# EAGLE design radio_fm (EAGLE 7.1.0)
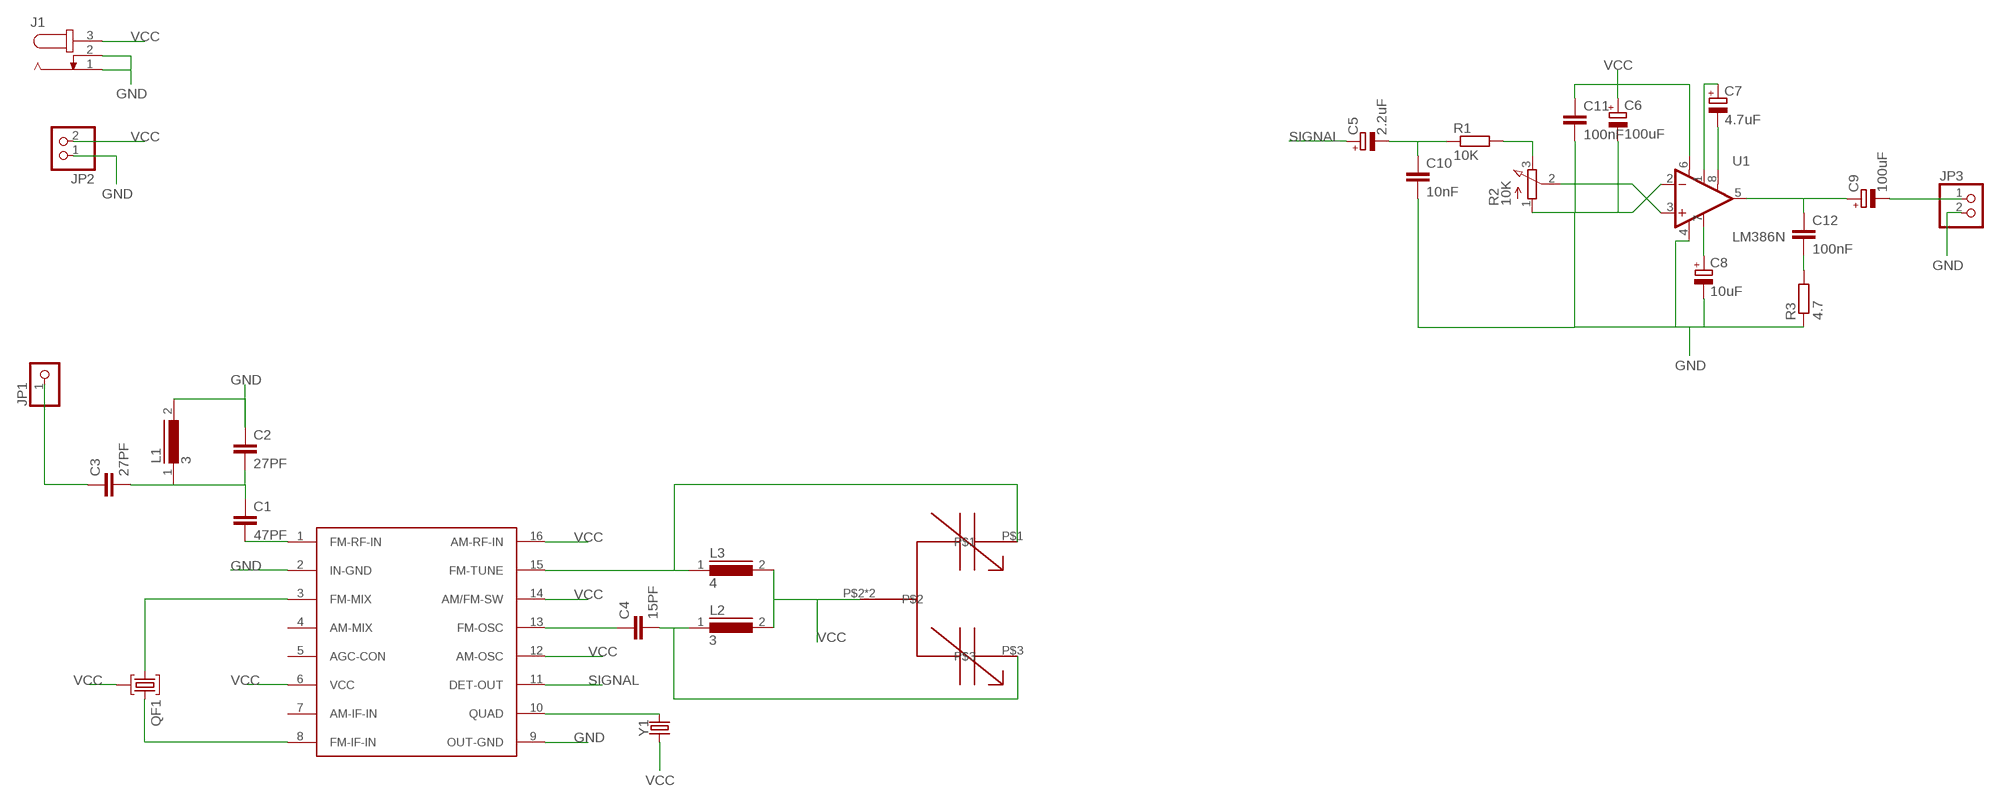
[diagram p0: schematic, sheet 1]

## Parts
C1  47PF  C-EU025-040X050  [C025-040X050]
C2  27PF  C-EU025-040X050  [C025-040X050]
C3  27PF  C-EU025-040X050  [C025-040X050]
C4  15PF  C-EU025-040X050  [C025-040X050]
C5  2.2uF  CPOL-EUE2,5-6E  [E2,5-6E]
C6  100uF  CPOL-EUE2,5-6E  [E2,5-6E]
C7  4.7uF  CPOL-EUE2,5-6E  [E2,5-6E]
C8  10uF  CPOL-EUE2,5-6E  [E2,5-6E]
C9  100uF  CPOL-EUE2,5-6E  [E2,5-6E]
C10  10nF  C-EU050-030X075  [C050-030X075]
C11  100nF  C-EU050-030X075  [C050-030X075]
C12  100nF  C-EU050-030X075  [C050-030X075]
J1  JACK-PLUG0  [SPC4077]
JP1  PINHD-1X1  [1X01]
JP2  PINHD-1X2  [1X02]
JP3  PINHD-1X2  [1X02]
L1  3  82114R  [82114R]
L2  3  82114R  [82114R]
L3  4  82114R  [82114R]
QF1  10M7AHC49T  [HC49U]
R1  10K  R-EU_0207/7  [0207/7]
R2  10K  3RP/1610N  [3RP/1610N]
R3  4.7  R-EU_0207/7  [0207/7]
U1  LM386N  LM386  [DIP08]
U$1  TA2003  [DIL16]
U$2  VARCO_KEMATIAN_V2  [VARCO_KEMATIAN2]
Y1  CRYSTALPTH-HC49US  [HC49US]

## Nets
GND: C2.1 C6.- C8.- C10.2 C11.2 J1.1 J1.2 JP2.1 JP3.2 L1.2 R2.1(A) R3.1 U1.2(-IN) U1.4(V-) U$1.2(IN-GND) U$1.9(OUT-GND)
N$1: C1.1 C2.2 C3.2 L1.1
N$2: C3.1 JP1.1
N$3: C1.2 U$1.1(FM-RF-IN)
N$4: QF1.1 U$1.3(FM-MIX)
N$5: QF1.3 U$1.8(FM-IF-IN)
N$6: U$1.10(QUAD) Y1.2
N$7: C4.1 U$1.13(FM-OSC)
N$8: L3.1 U$1.15(FM-TUNE) U$2.P$1
N$9: C4.2 L2.1 U$2.P$3
N$10: C5.- C10.1 R1.1
N$11: R1.2 R2.3(E)
N$12: R2.2(S) U1.3(+IN)
N$13: C12.2 R3.2
N$14: C8.+ U1.7(BP)
N$15: C9.+ C12.1 U1.5(OUT)
N$16: C7.- U1.8(GAIN)
N$17: C7.+ U1.1(GAIN)
N$18: C9.- JP3.1
SIGNAL: C5.+ U$1.11(DET-OUT)
VCC: C6.+ C11.1 J1.3 JP2.2 L2.2 L3.2 QF1.2 U1.6(V+) U$1.6(VCC) U$1.12(AM-OSC) U$1.14(AM/FM-SW) U$1.16(AM-RF-IN) U$2.P$2 U$2.P$4 Y1.1
Unconnected: U$1.4(AM-MIX) U$1.5(AGC-CON) U$1.7(AM-IF-IN)

## Library data of the parts
C1-C4 C10-C12 = rcl:C-EU: CAPACITOR, European symbol
C5-C9 = rcl:CPOL-EU: POLARIZED CAPACITOR, European symbol
J1 = con-jack:JACK-PLUG: DC POWER JACK Power Jack, DC, Right Angle, Through Hole, Rated 5A at 16VDC, PC Terminals Distributor: Farnell (www.Farnell.de) Drawing: 84N1161.pdf / 84N1162.pdf Manufacturer: SPC Technology (www.spctechnology.com) Type: SPC4077 / SPC 4078; OC_FARNELL: unknown; OC_NEWARK: unknown
JP1 = pinhead:PINHD-1X1: PIN HEADER
JP2 JP3 = pinhead:PINHD-1X2: PIN HEADER
L1-L3 = inductors:82114R: INDUCTOR
QF1 = crystal:10M*A: Monolithic Crystal Filters Source: www.vanlong.com; OC_FARNELL: unknown; OC_NEWARK: unknown
R1 R3 = rcl:R-EU_: RESISTOR, European symbol
R2 = pot:3RP/1610N: 16mm Potentiometer one level Source: http://www.alphapotentiometers.net/html/16mm_pot_2.html
U1 = SparkFun-IC-Amplifiers:LM386: low voltage audio power amplifier SparkFun Products FabFM Radio Kit <https://www.sparkfun.com/products/11043> (KIT-11043); PROD_ID: IC-10899
U$1 = uln-udn:TA2003
U$2 = diy_bojar:VARCO_KEMATIAN_V2
Y1 = SparkFun-Clocks:CRYSTAL: Crystals (Generic) These are passive quartz crystals, which can be used as a clock source for a microcontroller. Crystal's are two-terminal devices. They require external "load" capacitors to generate an oscillating signal.

## Board
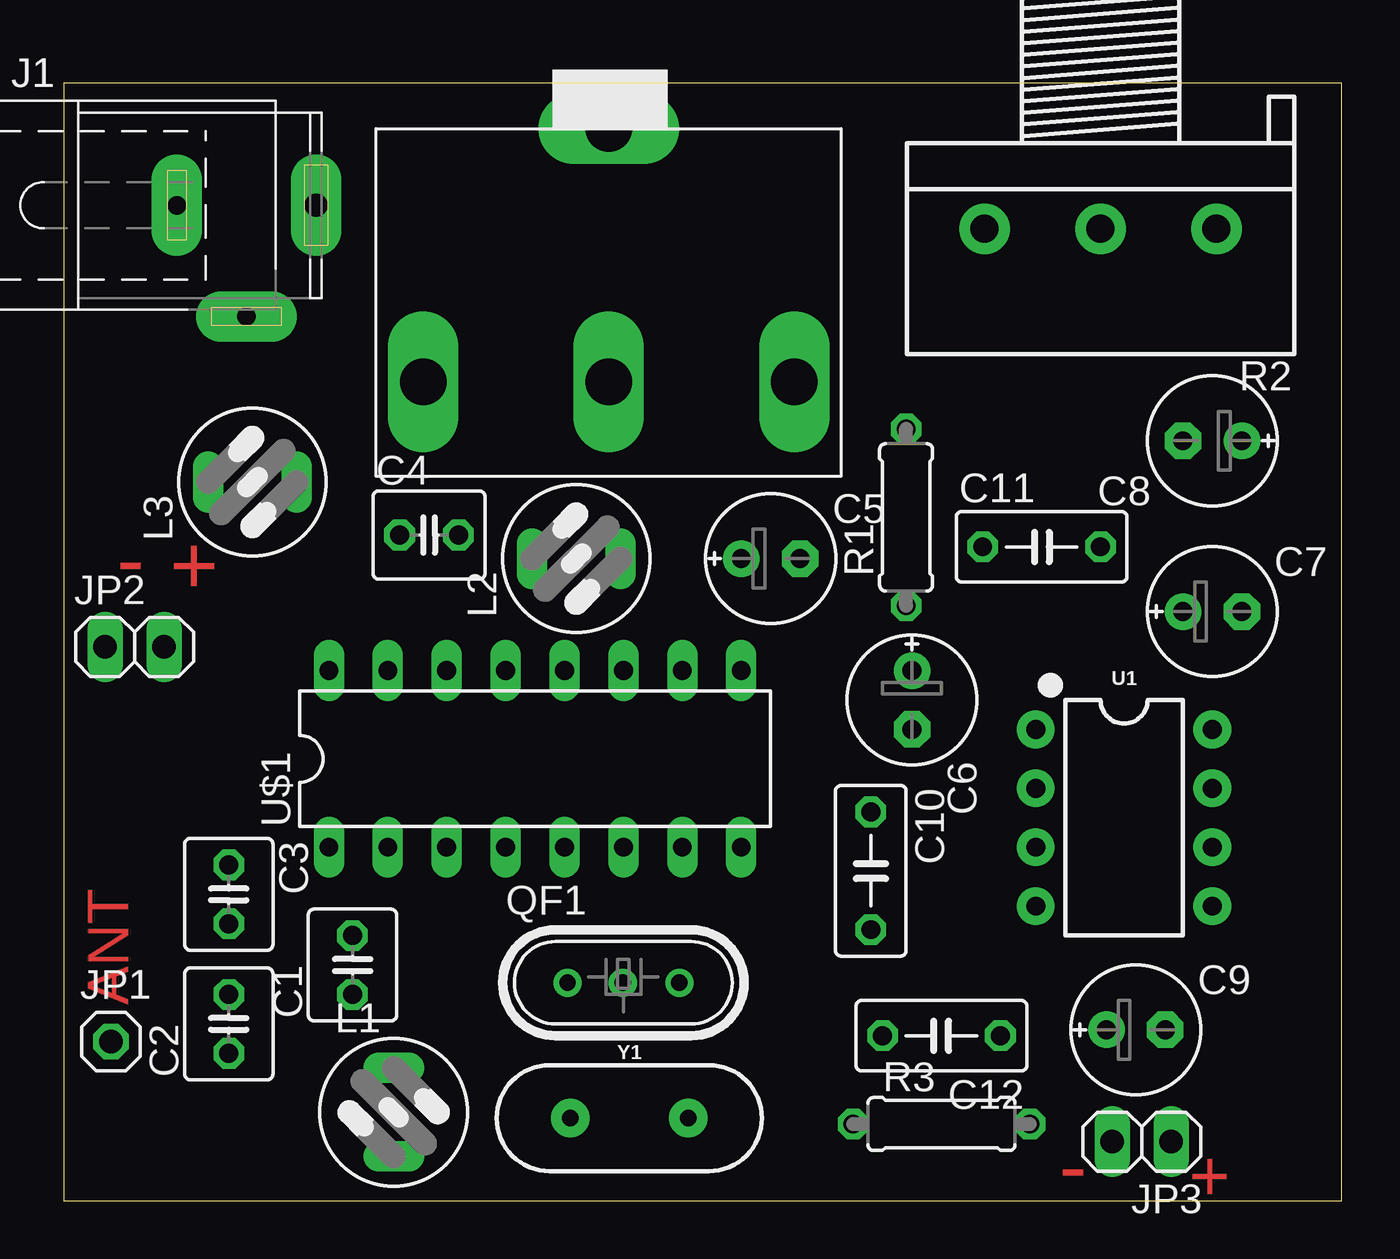
[diagram p1: board, top side]
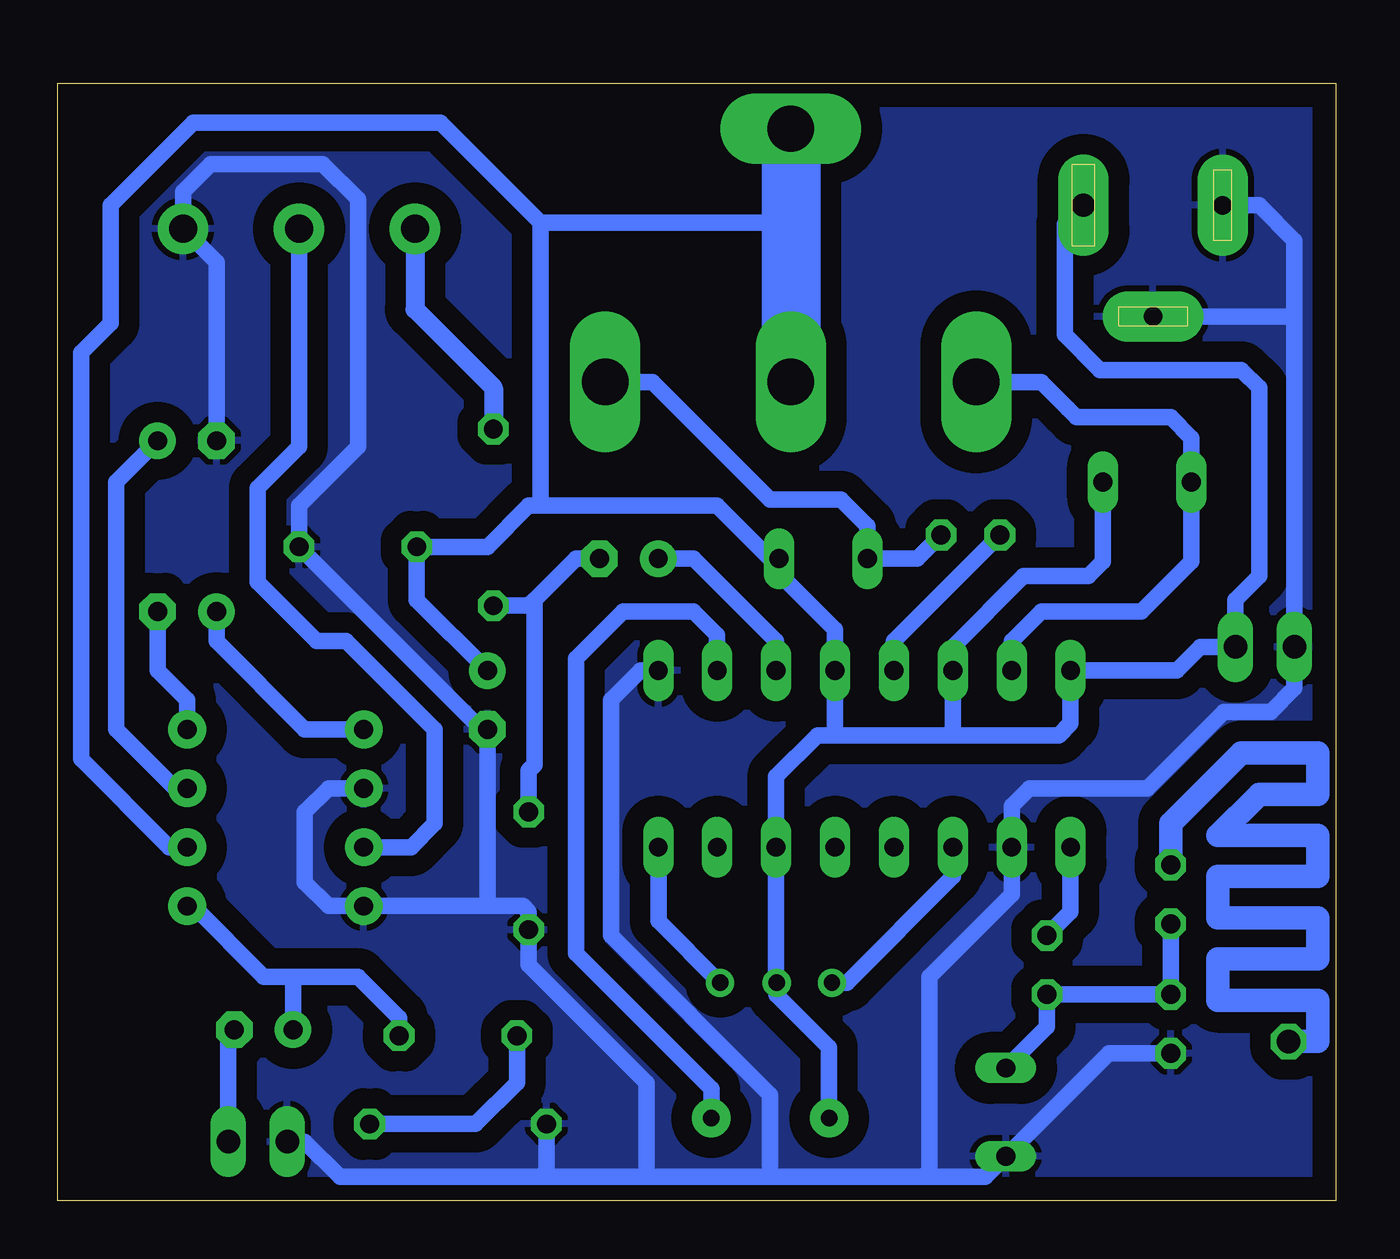
[diagram p2: board, bottom side, seen from below]

Size 55.1 x 48.18 mm. Coordinates in mm from the lower left corner, seen from the top.
Outline: 0,0 55.1,0 55.1,48.18 0,48.18 0,0
Copper layers (1*16): Top 0.035mm / dielectric 1.5mm / Bottom 0.035mm
Design rules "default *": minimum track width 10mil, minimum drill 24mil, track to track 35mil, track to pad 35mil, pad to pad 8mil, via to via 8mil, smd to smd 8mil, copper to edge 40mil, drill to drill 8mil, minimum pad ring 10mil, minimum via ring 8mil, stop-mask expansion 4mil, vias tented up to drill 0mil, thermal gap 10mil

### Footprints (pad centres in the part's own frame; a part is rotated, then mirrored left to right if it is on the bottom)
C025-040X050 = drill 0.813 octagon: 1 -1.27,0; 2 1.27,0
E2,5-6E = drill 0.813 pad 1.575: + -1.27,0 | drill 0.813 pad 1.575 octagon: - 1.27,0
C050-030X075 = drill 0.813 octagon: 1 -2.54,0; 2 2.54,0
SPC4077 = drill 0.8 pad 2.184 long: 1 -3,0; 2 0,-4.8 | drill 1 pad 2.184 long: 3 3,0
1X01 = drill 1.016 octagon: 1 0,0
1X02 = drill 1.016 long: 1 -1.27,0; 2 1.27,0
82114R = drill 0.813 long: 1 0,1.905; 2 0,-1.905
HC49U = drill 0.7 pad 1.2: 1 -2.413,0; 2 -0.027,0; 3 2.413,0
0207/7 = drill 0.813 octagon: 1 -3.81,0; 2 3.81,0
3RP/1610N = drill 1.2 pad 2.184: 1 -5,0; 2 0,0; 3 5,0
DIP08 = drill 0.813 pad 1.626: 1 -3.81,-3.81; 2 -1.27,-3.81; 3 1.27,-3.81; 4 3.81,-3.81; 5 3.81,3.81; 6 1.27,3.81; 7 -1.27,3.81; 8 -3.81,3.81
DIL16 = drill 0.813 long: 1 -8.89,-3.81; 2 -6.35,-3.81; 3 -3.81,-3.81; 4 -1.27,-3.81; 5 1.27,-3.81; 6 3.81,-3.81; 7 6.35,-3.81; 8 8.89,-3.81; 9 8.89,3.81; 10 6.35,3.81; 11 3.81,3.81; 12 1.27,3.81; 13 -1.27,3.81; 14 -3.81,3.81; 15 -6.35,3.81; 16 -8.89,3.81
VARCO_KEMATIAN2 = drill 2 pad 3.048 long: P$1 -8.128,-1.016; P$2 -0.127,-1.016; P$3 7.874,-1.016; P$4 -0.127,9.906
HC49US = drill 0.7 pad 1.651: 1 -2.54,0; 2 2.54,0

### Placement (x,y rotation side)
C1  12.45,10.16 90 top
C2  7.11,7.62 90 top
C3  7.11,13.21 270 top
C4  15.75,28.7 0 top
C5  30.48,27.69 0 top
C6  36.58,21.59 270 top
C7  49.53,25.4 0 top
C8  49.53,32.77 180 top
C9  46.23,7.37 0 top
C10  34.8,14.22 270 top
C11  42.16,28.19 0 top
C12  37.85,7.11 180 top
J1  7.87,42.93 0 top
JP1  2.03,6.86 0 top
JP2  3.05,23.88 0 top
JP3  46.48,2.54 180 top
L1  14.22,3.81 0 top
L2  22.1,27.69 90 top
L3  8.13,30.99 90 top
QF1  24.13,9.4 0 top
R1  36.32,29.46 90 top
R2  44.7,41.91 180 top
R3  37.85,3.3 0 top
U1  45.72,16.51 270 top
U$1  20.32,19.05 0 top
U$2  23.62,36.32 0 top
Y1  24.38,3.56 0 top

### Tracks (layer width: path | path; a pad name or v marks a point on that pad's centre or on a via)
GND
  Bottom 0.711: U$1.9 29.97,22.86 31.24,21.59 31.24,11.43 24.38,4.57 24.38,1.02 | 24.38,1.02 29.72,1.02 | 17.78,1.02 24.38,1.02 | C2.1 9.78,6.35 L1.2 15.11,1.02 17.78,1.02 | 17.78,1.02 17.53,1.27 17.53,9.65 13.97,13.21 U$1.2 13.97,17.02 13.21,17.78 8.13,17.78 4.83,21.08 2.79,21.08 1.78,22.1 JP2.1 1.78,38.1 | 1.78,38.1 1.78,41.4 3.3,42.93 J1.1 | J1.2 1.8,38.13 1.78,38.1 | U1.2 43.43,17.78 44.45,16.76 44.45,13.72 43.43,12.7 U1.4 36.58,12.7 | 36.58,12.7 35.05,12.7 34.8,12.45 C10.2 34.8,10.16 29.72,5.08 29.72,1.02 | 36.58,12.7 C6.- 36.83,20.32 C11.2 44.7,29.97 42.16,32.51 42.16,43.18 43.69,44.7 48.51,44.7 49.7,43.51 R2.1 48.26,40.47 C8.- | JP3.2 44.45,2.54 42.93,1.02 34.29,1.02 | 29.72,1.02 34.29,1.02 | R3.1 34.04,1.27 34.29,1.02
  pour Bottom: 0,48.26 55.12,48.26 55.12,0 0,0
N$1
  Bottom 0.711: C3.2 C2.2 C1.1 12.45,7.49 L1.1
N$2
  Bottom 1.016: JP1.1 0.76,6.86 0.76,8.64 5.08,8.64 5.08,10.41 0.76,10.41 0.76,12.19 5.08,12.19 5.08,13.97 0.76,13.97 0.76,15.75 5.08,15.75 3.3,17.53 0.76,17.53 0.76,19.3 4.06,19.3 7.11,16.26 C3.1
N$3
  Bottom 0.711: U$1.1 11.43,12.45 C1.2
N$4
  Bottom 0.711: U$1.3 16.51,13.97 21.08,9.4 QF1.1
N$5
  Bottom 0.711: U$1.8 29.21,12.07 QF1.3
N$6
  Bottom 0.711: Y1.2 26.92,4.83 32.77,10.67 32.77,23.37 30.73,25.4 27.69,25.4 26.67,24.38 U$1.10
N$7
  Bottom 0.711: C4.1 19.05,24.13 U$1.13
N$8
  Bottom 0.711: U$1.15 13.97,24.13 12.7,25.4 8.38,25.4 6.22,27.56 L3.1 6.22,32.89 7.11,33.78 11.18,33.78 11.56,34.16 12.7,35.31 U$2.P$1
N$9
  Bottom 0.711: C4.2 18.03,27.69 L2.1 20.19,29.08 21.34,30.23 24.38,30.23 29.46,35.31 U$2.P$3
N$10
  Bottom 0.711: C10.1 34.8,18.54 34.54,18.8 34.54,25.91 | R1.1 34.8,25.65 34.54,25.91 | C5.- 32.77,27.69 34.54,25.91
N$11
  Bottom 0.813: R2.3 39.7,38.43 36.32,35.05 R1.2
N$12
  Bottom 0.711: U1.3 39.88,15.24 38.86,16.26 38.86,20.32 42.67,24.13 43.94,24.13 46.48,26.67 46.48,30.73 44.7,32.51 R2.2
N$13
  Bottom 0.711: R3.2 37.08,3.3 35.31,5.08 C12.2
N$14
  Bottom 0.711: U1.7 50.04,17.78 52.58,20.32 52.58,30.99 C8.+
N$15
  Bottom 0.711: U1.5 49.28,12.7 46.23,9.65 44.96,9.65 | C12.1 40.39,7.87 42.16,9.65 44.96,9.65 | C9.+ 44.96,9.65
N$16
  Bottom 0.711: C7.- 50.8,22.86 49.53,21.59 U1.8
N$17
  Bottom 0.711: U1.1 44.45,20.32 48.26,24.13 C7.+
N$18
  Bottom 0.711: JP3.1 47.75,7.11 C9.-
SIGNAL
  Bottom 0.711: C5.+ 27.69,27.69 24.13,24.13 U$1.11
VCC
  Bottom 0.711: Y1.1 21.84,6.6 24.1,8.86 QF1.2 24.13,9.43 U$1.6 24.13,18.29 22.35,20.07 21.59,20.07 | 16.76,20.07 11.94,20.07 11.43,20.57 U$1.16 6.86,22.86 5.84,23.88 JP2.2 4.32,25.91 3.3,26.92 3.3,35.05 4.06,35.81 10.16,35.81 11.68,37.34 11.68,42.12 J1.3 | 16.76,20.07 21.59,20.07 | 21.59,20.07 U$1.12 21.59,24.64 24,27.05 L2.2 24.38,27.69 26.67,29.97 34.29,29.97 | 16.76,20.07 16.51,20.32 U$1.14 16.51,23.88 13.46,26.92 10.67,26.92 10.03,27.56 L3.2 | 34.29,42.16 23.49,42.16 | 34.29,29.97 34.8,29.97 36.58,28.19 C11.1 39.62,25.91 C6.+ | 34.29,29.97 34.29,42.16 | 34.29,42.16 38.61,46.48 49.28,46.48 52.83,42.93 52.83,37.85 54.1,36.58 54.1,19.05 50.29,15.24 U1.6
  Bottom 2.54: U$2.P$4 23.49,42.16 U$2.P$2

### Text on the board
Top: - | + | ANT | - | +